# EAGLE schematic untitled (EAGLE 5.06)
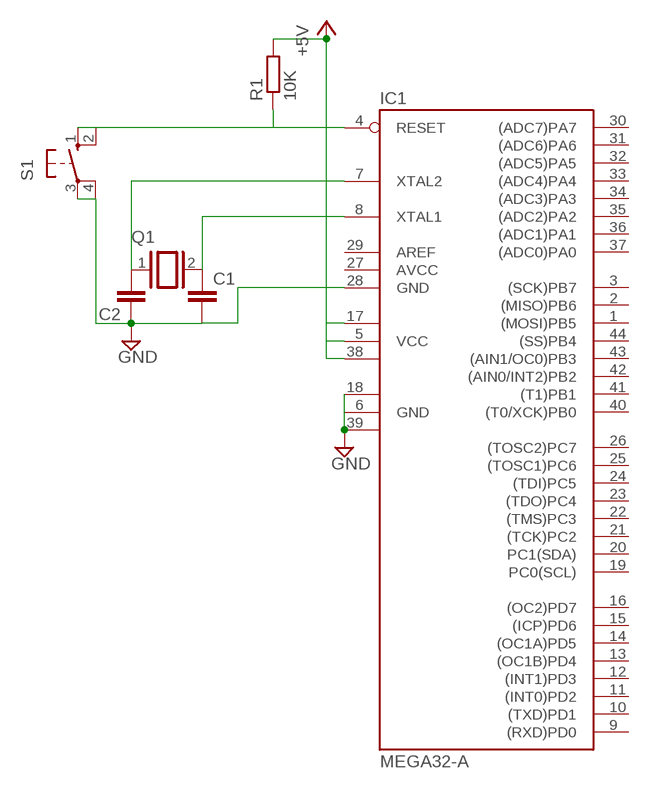
[diagram p0: schematic, sheet 1]

## Parts
C1  C-EU050-025X075  [C050-025X075]
C2  C-EU050-025X075  [C050-025X075]
IC1  MEGA32-A  [TQFP44]
Q1  XTAL/S  [QS]
R1  10K  R-EU_0207/7  [0207/7]
S1  10-XX  [B3F-10XX]

## Nets
+5V: IC1.5(VCC) IC1.17(VCC1) IC1.38(VCC2) R1.2
GND: C1.2 C2.1 IC1.6(GND) IC1.18(GND1) IC1.28(GND) IC1.39(GND2) S1.3(P) S1.4(P1)
N$1: C2.2 IC1.7(XTAL2) Q1.1
N$2: C1.1 IC1.8(XTAL1) Q1.2
N$4: IC1.4(RESET) R1.1 S1.1(S) S1.2(S1)
Unconnected: IC1.1((MOSI)PB5) IC1.2((MISO)PB6) IC1.3((SCK)PB7) IC1.9((RXD)PD0) IC1.10((TXD)PD1) IC1.11((INT0)PD2) IC1.12((INT1)PD3) IC1.13((OC1B)PD4) IC1.14((OC1A)PD5) IC1.15((ICP)PD6) IC1.16((OC2)PD7) IC1.19(PC0(SCL)) IC1.20(PC1(SDA)) IC1.21((TCK)PC2) IC1.22((TMS)PC3) IC1.23((TDO)PC4) IC1.24((TDI)PC5) IC1.25((TOSC1)PC6) IC1.26((TOSC2)PC7) IC1.29(AREF) IC1.30((ADC7)PA7) IC1.31((ADC6)PA6) IC1.32((ADC5)PA5) IC1.33((ADC4)PA4) IC1.34((ADC3)PA3) IC1.35((ADC2)PA2) IC1.36((ADC1)PA1) IC1.37((ADC0)PA0) IC1.40((T0/XCK)PB0) IC1.41((T1)PB1) IC1.42((AIN0/INT2)PB2) IC1.43((AIN1/OC0)PB3) IC1.44((SS)PB4)

## Power pins joined to a net without a drawn wire
AVCC: IC1.27(AVCC)

## Library data of the parts
C1 C2 = resistor:C-EU: CAPACITOR, European symbol
IC1 = atmel:MEGA32: MICROCONTROLLER 32 Kbytes FLASH 2 Kbytes SRAM 1 Kbytes EEPROM USART 8-channel 10 bit ADC Source: www.atmel.com .. doc2503.pdf
Q1 = special:XTAL/S: CRYSTAL
R1 = resistor:R-EU_: RESISTOR, European symbol
S1 = switch-omron:10-XX: OMRON SWITCH